# Altium schematic sheet Thoi_gian_thuc.SchDoc
size A4; Author: Đỗ Ngọc Quý; Organization: Altium Limited; Address1: L3, 12a Rodborough Rd; Address2: Frenchs Forest; Address3: NSW; Address4: Australia 2086; DocumentNumber: 1; SheetNumber: 1; SheetTotal: 2
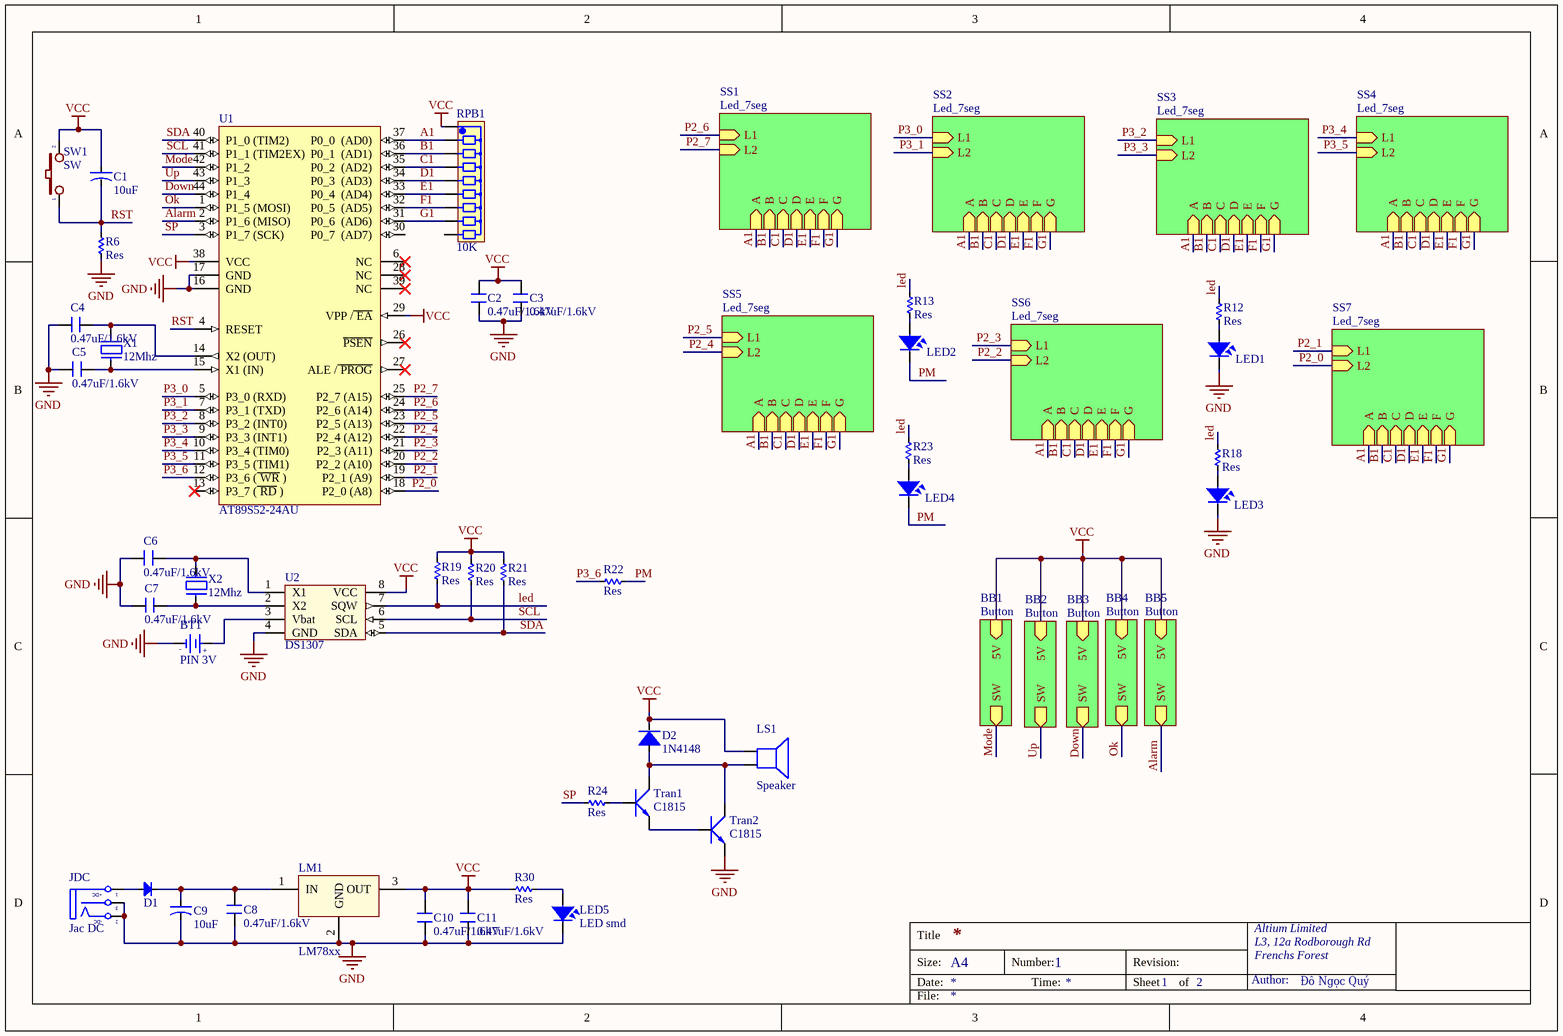
[diagram p0: Thoi_gian_thuc.SchDoc]

## Parts
BT1  PIN 3V  [PIN CR1220-SMD]
C1  10uF  [CA-ALU-2.54]
C2  0.47uF/1.6kV  [cap 0805]
C3  0.47uF/1.6kV  [cap 0805]
C4  0.47uF/1.6kV  [cap 0805]
C5  0.47uF/1.6kV  [cap 0805]
C6  0.47uF/1.6kV  [cap 0805]
C7  0.47uF/1.6kV  [cap 0805]
C8  0.47uF/1.6kV  [cap 0805]
C9  10uF  [CA-ALU-2.54]
C10  0.47uF/1.6kV  [cap 0805]
C11  0.47uF/1.6kV  [cap 0805]
D1  Diode  [DIO-2A]  (value not drawn)
D2  1N4148  [SOD123]
JDC  Jac DC  [DC0]
LED1  LED  [LED-3MM-RED]  (value not drawn)
LED2  LED  [LED-3MM-RED]  (value not drawn)
LED3  LED  [LED-3MM-RED]  (value not drawn)
LED4  LED  [LED-3MM-RED]  (value not drawn)
LED5  LED smd  [LED-0805-Red]
LM1  LM78xx  [TO220-H3]
LS1  Speaker  [SPEAKER]
R6  Res  [RES-SMD-0805]
R12  Res  [RES-SMD-0805]
R13  Res  [RES-SMD-0805]
R18  Res  [RES-SMD-0805]
R19  Res  [RES-SMD-0805]
R20  Res  [RES-SMD-0805]
R21  Res  [RES-SMD-0805]
R22  Res  [RES-SMD-0805]
R23  Res  [RES-SMD-0805]
R24  Res  [RES-SMD-0805]
R30  Res  [RES-SMD-0805]
RPB1  10K  [RN8]
SW1  SW  [SW-SMD_apes]
Tran1  C1815  [C1815]
Tran2  C1815  [C1815]
U1  AT89S52-24AU  [TQFP44]
U2  DS1307  [DS1307 SMD]
X1  12Mhz  [XT2]
X2  12Mhz  [XT32k]

## Sub-sheets
BB1 = Button: 5V (in), SW (out)
BB2 = Button: 5V (in), SW (out)
BB3 = Button: 5V (in), SW (out)
BB4 = Button: 5V (in), SW (out)
BB5 = Button: 5V (in), SW (out)
SS1 = Led_7seg: L2 (in), L1 (in), C (in), G (in), F (in), A (in), D (in), E (in), B (in)
SS2 = Led_7seg: L2 (in), L1 (in), C (in), G (in), F (in), A (in), D (in), E (in), B (in)
SS3 = Led_7seg: L2 (in), L1 (in), C (in), G (in), F (in), A (in), D (in), E (in), B (in)
SS4 = Led_7seg: L2 (in), L1 (in), C (in), G (in), F (in), A (in), D (in), E (in), B (in)
SS5 = Led_7seg: L2 (in), L1 (in), C (in), G (in), F (in), A (in), D (in), E (in), B (in)
SS6 = Led_7seg: L2 (in), L1 (in), C (in), G (in), F (in), A (in), D (in), E (in), B (in)
SS7 = Led_7seg: L2 (in), L1 (in), C (in), G (in), F (in), A (in), D (in), E (in), B (in)

## Nets
GND: BT1.2(GND) C2.1 C3.1 C4.1 C5.1 C6.1 C7.1 C8.1 C9.2 C10.1 C11.1 JDC.2(TN) JDC.3(S) LED1.2 LED3.2 LED5.2 LM1.2(GND) R6.1 Tran2.2(E) U1.16(GND) U1.17(GND) U2.4(GND)
VCC: C1.1 C2.2 C3.2 C10.2 C11.2 D2.K LM1.3(OUT) LS1.1 R19.2 R20.2 R21.2 R30.2 RPB1.1 SW1.2 U1.29(VPP_/~{_EA}) U1.38(VCC) U2.8(VCC) ; sheet BB1/5V, sheet BB2/5V, sheet BB3/5V, sheet BB4/5V, sheet BB5/5V
A1: RPB1.2 U1.37(P0_0__(AD0)) ; sheet SS1/A, sheet SS2/A, sheet SS3/A, sheet SS4/A, sheet SS5/A, sheet SS6/A, sheet SS7/A
Alarm: U1.2(P1_6_(MISO)) ; sheet BB5/SW
B1: RPB1.3 U1.36(P0_1__(AD1)) ; sheet SS1/B, sheet SS2/B, sheet SS3/B, sheet SS4/B, sheet SS5/B, sheet SS6/B, sheet SS7/B
C1: RPB1.4 U1.35(P0_2__(AD2)) ; sheet SS1/C, sheet SS2/C, sheet SS3/C, sheet SS4/C, sheet SS5/C, sheet SS6/C, sheet SS7/C
D1: RPB1.5 U1.34(P0_3__(AD3)) ; sheet SS1/D, sheet SS2/D, sheet SS3/D, sheet SS4/D, sheet SS5/D, sheet SS6/D, sheet SS7/D
Down: U1.44(P1_4) ; sheet BB3/SW
E1: RPB1.6 U1.33(P0_4__(AD4)) ; sheet SS1/E, sheet SS2/E, sheet SS3/E, sheet SS4/E, sheet SS5/E, sheet SS6/E, sheet SS7/E
F1: RPB1.7 U1.32(P0_5__(AD5)) ; sheet SS1/F, sheet SS2/F, sheet SS3/F, sheet SS4/F, sheet SS5/F, sheet SS6/F, sheet SS7/F
G1: RPB1.8 U1.31(P0_6__(AD6)) ; sheet SS1/G, sheet SS2/G, sheet SS3/G, sheet SS4/G, sheet SS5/G, sheet SS6/G, sheet SS7/G
led: R12.1 R13.1 R18.1 R19.1 R23.1 U2.7(SQW)
Mode: U1.42(P1_2) ; sheet BB1/SW
Ok: U1.1(P1_5_(MOSI)) ; sheet BB4/SW
P2_0: U1.18(P2_0_(A8)) ; sheet SS7/L2
P2_1: U1.19(P2_1_(A9)) ; sheet SS7/L1
P2_2: U1.20(P2_2_(A10)) ; sheet SS6/L2
P2_3: U1.21(P2_3_(A11)) ; sheet SS6/L1
P2_4: U1.22(P2_4_(A12)) ; sheet SS5/L2
P2_5: U1.23(P2_5_(A13)) ; sheet SS5/L1
P2_6: U1.24(P2_6_(A14)) ; sheet SS1/L1
P2_7: U1.25(P2_7_(A15)) ; sheet SS1/L2
P3_0: U1.5(P3_0_(RXD)) ; sheet SS2/L1
P3_1: U1.7(P3_1_(TXD)) ; sheet SS2/L2
P3_2: U1.8(P3_2_(INT0)) ; sheet SS3/L1
P3_3: U1.9(P3_3_(INT1)) ; sheet SS3/L2
P3_4: U1.10(P3_4_(TIM0)) ; sheet SS4/L1
P3_5: U1.11(P3_5_(TIM1)) ; sheet SS4/L2
P3_6: R22.1 U1.12(P3_6_(~{_WR}_))
PM: LED2.2 LED4.2 R22.2
RST: C1.2 R6.2 SW1.1 U1.4(RESET)
SCL: R20.1 U1.41(P1_1_(TIM2EX)) U2.6(SCL)
SDA: R21.1 U1.40(P1_0_(TIM2)) U2.5(SDA)
SP: R24.2 U1.3(P1_7_(SCK))
Up: U1.43(P1_3) ; sheet BB2/SW
NetBT1_1: BT1.1(+3V) U2.3(Vbat)
NetC4_2: C4.2 U1.14(X2_(OUT)) X1.2
NetC5_2: C5.2 U1.15(X1_(IN)) X1.1
NetC6_2: C6.2 U2.1(X1) X2.2
NetC7_2: C7.2 U2.2(X2) X2.1
NetC8_2: C8.2 C9.1 D1.2(K) LM1.1(IN)
NetD1_1: D1.1(A) JDC.1(T)
NetD2_A: D2.A LS1.2 Tran1.3(C) Tran2.3(C)
NetLED1_1: LED1.1 R12.2
NetLED2_1: LED2.1 R13.2
NetLED3_1: LED3.1 R18.2
NetLED4_1: LED4.1 R23.2
NetLED5_1: LED5.1 R30.1
NetR24_1: R24.1 Tran1.1(B)
NetTran1_2: Tran1.2(E) Tran2.1(B)

Not connected (* = marked no-connect by the designer): RPB1 9; U1 6(NC)* 13(P3_7_(~{_RD}_))* 26(~{PSEN})* 27(ALE_/~{_PROG})* 28(NC)* 30(P0_7__(AD7)) 39(NC)*

## Notes on the sheet
- Title
- Size:
- Date:
- A4
- Number:
- Time:
- Revision:
- Sheet
- of
- Author:
- File:
- (in symbol DCIN) +DC; -DC
- (in symbol PIN 3V) -; +

## Library data of the parts
BT1 = PIN 3V: Battery 3VDC; Value: PIN 3V
C1 C9 = CN-ALU-DIP: Capacitor (Semiconductor SIM Model); Value: 104; LatestRevisionDate: 17-Jul-2002; LatestRevisionNote: Re-released for DXP Platform.; PackageReference: C1206; Publisher: Altium Limited
C2-C8 C10 C11 = Cap
D1 = Diode: Default Diode; Code - JEDEC: DO-214-AB; Value: 1N5007; Published: 8-Jun-2000; Revision: July-2002: Re-released for DXP Platform.; Publisher: Altium Limited
D2 = Diode 1N4148
JDC = DCIN: Jac DC input; Value: Jac DC
LED1-LED4 = LED: LED Single colour Green and Red; Value: LED 3 ly Single Colour
LS1 = Speaker: Loudspeaker; Published: 24-Mar-1999; LatestRevisionDate: 17-Jul-2002; LatestRevisionNote: Re-released for DXP Platform.; PackageReference: PIN2; Publisher: Altium Limited
R6 R12 R13 R18-R24 R30 = Res-SMD: Resistor; Manufacturer: Generic Components; Class: Passive; Published: 08/06/2000; Publisher: Altium Hobart Technology Centre
RPB1 = RN8: Resistor 8 (Thanh); Value: Tro thanh 10K
SW1 = SW2: Switch button 2 pin; Value: SW chip 2 pin
U1 = AT89S52-24AU: Atmel 8 Bit Micro 4.0-5.5V 24MHz -40 to +80 Deg C 44TQFP (44A) Package GREEN OPTION; GREEN OPTION: YES; Vendor: ATMEL; PartNr: AT89S52-24AU; Package: 44A 44-lead, Thin Plastic Gull Wing Quad Flatpack (TQFP)
X1 X2 = XT2_1: Crystal, 32.768 KHz, -40 to 85 degC, 3.2 x 1.5 x 0.9 mm SMD; Value: 4Mhz